# Altium project Arrows Keypad.PrjPcb
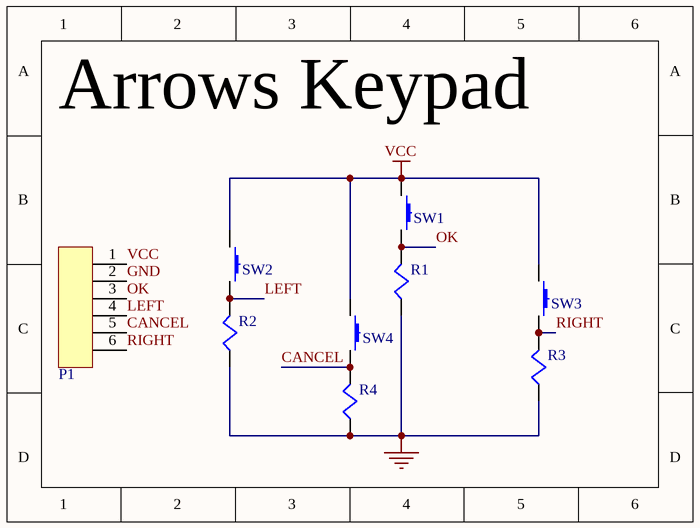
[diagram p0: Arrows Keypad.SchDoc]
1 sheet, 9 parts. Net scope: global (net labels, ports and power ports of the same name join across sheets).
Board file: Arrows Keypad.PcbDoc

## Sheet Arrows Keypad.SchDoc
size 101 x 76 mm

### Parts
P1  Header bounded 6 Pins  [Header Male 2.54mm 6 Pins TH Right]  (value not drawn)
R1  10K 0.25W  [Res 7.62mm H TH]  (value not drawn)
R2  10K 0.25W  [Res 7.62mm H TH]  (value not drawn)
R3  10K 0.25W  [Res 7.62mm H TH]  (value not drawn)
R4  10K 0.25W  [Res 7.62mm H TH]  (value not drawn)
SW1  12*12 DIP tactile Green  [Tactile 12*12 TH Green Omron]  (value not drawn)
SW2  12*12 DIP tactile Yellow  [Tactile 12*12 TH Yellow Omron]  (value not drawn)
SW3  12*12 DIP tactile Yellow  [Tactile 12*12 TH Yellow Omron]  (value not drawn)
SW4  12*12 DIP tactile Red  [Tactile 12*12 TH Red Omron]  (value not drawn)

### Nets
GND: P1.2 R1.1 R2.1 R3.1 R4.1
VCC: P1.1 SW1.1 SW2.1 SW3.1 SW4.1
CANCEL: P1.5 R4.2 SW4.2
LEFT: P1.4 R2.2 SW2.2
OK: P1.3 R1.2 SW1.2
RIGHT: P1.6 R3.2 SW3.2

### Notes on the sheet
- Arrows Keypad

### Library data of the parts
P1 = Terminal_Block_6Pos: Male Header, Pitch 2.54 mm, 1 x 40 Position, Height 8.636 mm, Tail Length 3.05 mm, -55 to 105 degC, RoHS, Bulk; Manufacturer: 3M; Max Current Rating: 3A; Rows: 1; Contact Plating: Gold; Package Reference: 2340-6111TG; Connector Type: Header; RoHS Compliant: True; Colour: Black; Datasheet URL: https://datasheet.ciiva.com/5161/ts0766-242217-5161112.pdf; Contact Finish: Gold; Package Quantity: 200; Current Rating: 3A; Datasheet Version: Aug-08; Package Description: Male Header, Pitch 2.54 mm, 1 x 40 Position, Height 8.636 mm, Tail Length 3.05 mm; Mounting Technology: TH; Pins: 40; Max Operating Temperature: 105°C; Packaging: Bulk; Manufacturer URL: http://www.3m.com/; Min Operating Temperature: -55°C; Case/Package: 2340-6111TG; Gender: Male; Lead Pitch: 0.1inch; Contact Material: Copper
R1-R4 = Resistors_Single: Resistors; Manufacturer: Yageo; Manufacturer Part Number: CFR-25JB-52-100K; Max Power Dissipation: 250mW; Resistance: 100kR; Tolerance: 5%; Temperature Coefficient: -700ppm/°C; Supplier 1: Digi-Key; RoHS: Yes; Category: Through-Hole Resistors; Stock 1: 105911; Pricing 1: 1=0.10000, 25=0.04640, 50=0.03600, 100=0.02580, 250=0.02008, 500=0.01596, 750=0.01365, 1000=0.01133, 2000=0.00979 (USD); Case/Package: Axial; Min Operating Temperature: -55°C; Max Operating Temperature: 155°C; Package Quantity: 200; Packaging: Bulk; Power Rating: 250mW; Number of Terminations: 2; Resistor Type: Carbon Film; Length: 0.248inch; Lead Free: Lead Free; ComponentLink1URL: http://www.yageo.com/NewPortal/yageodocoutput?fileName=/pdf/throughhole/Yageo_LR_CFR_2013.pdf&src-supplier=Digi-Key; ComponentLink1Description: http://www.yageo.com/NewPortal/yageodocoutput?fileName=/pdf/throughhole/Yageo_LR_CFR_2013.pdf&src-supplier=Digi-Key; ComponentLink2URL: http://www.yageo.com/documents/recent/General%20Type_CFR.pdf?src-supplier=Future+Electronics; ComponentLink2Description: http://www.yageo.com/documents/recent/General%20Type_CFR.pdf?src-supplier=Future+Electronics; Supplier Part Number 1: 100KQBK-ND
SW1-SW4 = Switches_2Pos: Switches; Manufacturer: E-Switch; Manufacturer Part Number: TL1105LF160Q; Actuator Material: Nylon,Polyamide; Mechanical Life: 100000Cycles; Switch Function: Off-Mom; Illumination Type: Non-Illuminated; Switch Travel: 0.25mm; Throw Configuration: SPST; Contact Current Rating: 50mA; Operating Force: 160gf; Voltage Rating (DC): 12V; Max Voltage Rating (DC): 50V; Contact Resistance: 100mR; Actuator Type: Standard; Actuator Length: 13.4mm; Supplier 1: Digi-Key; RoHS: Yes; Category: Tactile Switches; Stock 1: 17577; Pricing 1: 1=0.29000, 10=0.27800, 25=0.26400, 100=0.23900, 250=0.21792, 500=0.20256, 1000=0.17280, 2500=0.16800, 5000=0.15840 (USD); Mount: Through Hole; Housing Material: Nylon; Contact Material: Silver,Bronze; Color: Black; Contact Plating: Silver; Min Operating Temperature: -20°C; Max Operating Temperature: 70°C; Orientation: Straight; Termination: PC Pin; Electrical Life: 100000Cycles; Package Quantity: 750; Packaging: Bulk; Current Rating: 50mA; Width: 6mm; Lead Free: Lead Free; ComponentLink1URL: https://datasheet.ciiva.com/16156/p010009-16156269.pdf?src-supplier=Onlinecomponents.com; ComponentLink1Description: https://datasheet.ciiva.com/16156/p010009-16156269.pdf?src-supplier=Onlinecomponents.com; ComponentLink2URL: https://datasheet.ciiva.com/2900/tl1105-2900888.pdf?src-supplier=Digi-Key; ComponentLink2Description: https://datasheet.ciiva.com/2900/tl1105-2900888.pdf?src-supplier=Digi-Key; Supplier Part Number 1: EG2505-ND